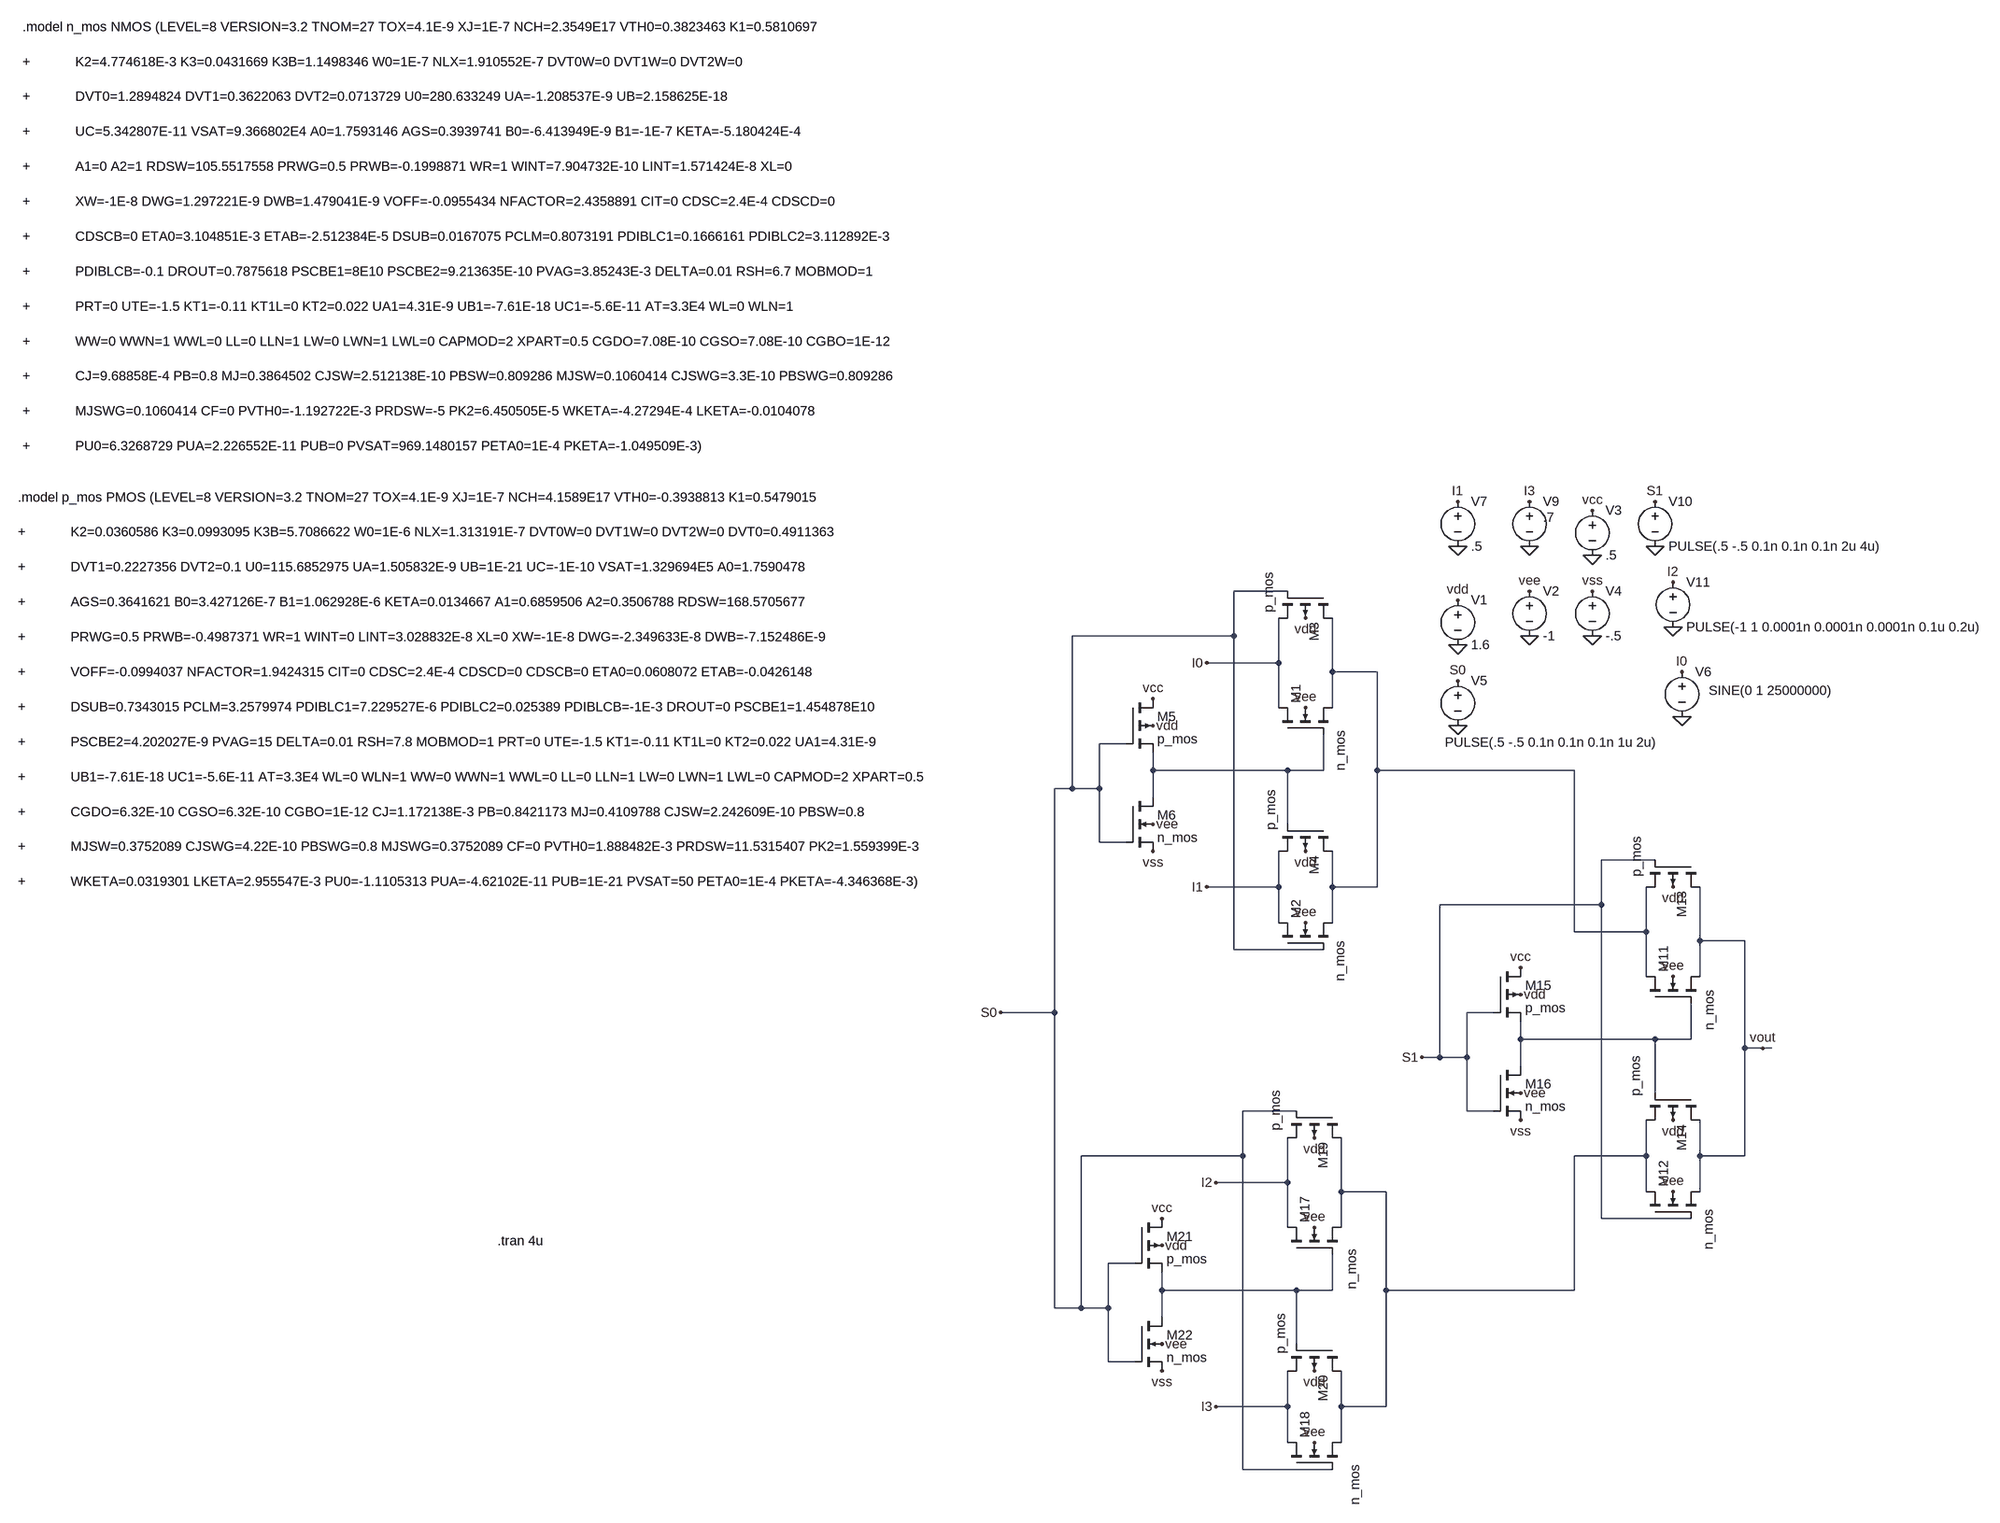
[diagram p0: schematic Data Acquisition System.asc]
Data Acquisition System.asc, the LTspice schematic file:
Version 4
SHEET 1 3424 1956
WIRE 1104 320 1008 320
WIRE 1008 400 1008 320
WIRE 1008 400 720 400
WIRE 1088 448 1088 368
WIRE 1088 448 960 448
WIRE 1184 464 1184 368
WIRE 1264 464 1184 464
WIRE 1088 528 1088 448
WIRE 1184 528 1184 464
WIRE 816 592 768 592
WIRE 864 640 864 608
WIRE 1104 640 864 640
WIRE 1168 640 1168 576
WIRE 1168 640 1104 640
WIRE 1264 640 1264 464
WIRE 1616 640 1264 640
WIRE 720 672 720 400
WIRE 720 672 688 672
WIRE 768 672 768 592
WIRE 768 672 720 672
WIRE 864 688 864 640
WIRE 1104 736 1104 640
WIRE 768 768 768 672
WIRE 816 768 768 768
WIRE 1760 800 1664 800
WIRE 1088 848 1088 784
WIRE 1088 848 960 848
WIRE 1184 848 1184 784
WIRE 1264 848 1264 640
WIRE 1264 848 1184 848
WIRE 1664 880 1664 800
WIRE 1664 880 1376 880
WIRE 1088 912 1088 848
WIRE 1184 912 1184 848
WIRE 1616 928 1616 640
WIRE 1744 928 1744 848
WIRE 1744 928 1616 928
WIRE 1840 944 1840 848
WIRE 1920 944 1840 944
WIRE 1008 960 1008 400
WIRE 1168 960 1008 960
WIRE 1744 1008 1744 928
WIRE 1840 1008 1840 944
WIRE 688 1072 688 672
WIRE 688 1072 592 1072
WIRE 1472 1072 1424 1072
WIRE 1520 1120 1520 1088
WIRE 1760 1120 1520 1120
WIRE 1824 1120 1824 1056
WIRE 1824 1120 1760 1120
WIRE 1920 1136 1920 944
WIRE 1952 1136 1920 1136
WIRE 1968 1136 1952 1136
WIRE 1376 1152 1376 880
WIRE 1376 1152 1344 1152
WIRE 1424 1152 1424 1072
WIRE 1424 1152 1376 1152
WIRE 1520 1168 1520 1120
WIRE 1760 1216 1760 1120
WIRE 1120 1248 1024 1248
WIRE 1424 1248 1424 1152
WIRE 1472 1248 1424 1248
WIRE 1024 1328 1024 1248
WIRE 1024 1328 736 1328
WIRE 1744 1328 1744 1264
WIRE 1744 1328 1616 1328
WIRE 1840 1328 1840 1264
WIRE 1920 1328 1920 1136
WIRE 1920 1328 1840 1328
WIRE 1104 1376 1104 1296
WIRE 1104 1376 976 1376
WIRE 1200 1392 1200 1296
WIRE 1280 1392 1200 1392
WIRE 1744 1392 1744 1328
WIRE 1840 1392 1840 1328
WIRE 1664 1440 1664 880
WIRE 1824 1440 1664 1440
WIRE 1104 1456 1104 1376
WIRE 1200 1456 1200 1392
WIRE 832 1520 784 1520
WIRE 880 1568 880 1536
WIRE 1120 1568 880 1568
WIRE 1184 1568 1184 1504
WIRE 1184 1568 1120 1568
WIRE 1280 1568 1280 1392
WIRE 1616 1568 1616 1328
WIRE 1616 1568 1280 1568
WIRE 688 1600 688 1072
WIRE 736 1600 736 1328
WIRE 736 1600 688 1600
WIRE 784 1600 784 1520
WIRE 784 1600 736 1600
WIRE 880 1616 880 1568
WIRE 1120 1664 1120 1568
WIRE 784 1696 784 1600
WIRE 832 1696 784 1696
WIRE 1104 1776 1104 1712
WIRE 1104 1776 976 1776
WIRE 1200 1776 1200 1712
WIRE 1280 1776 1280 1568
WIRE 1280 1776 1200 1776
WIRE 1104 1840 1104 1776
WIRE 1200 1840 1200 1776
WIRE 1024 1888 1024 1328
WIRE 1184 1888 1024 1888
FLAG 1408 416 0
FLAG 1536 400 0
FLAG 1648 256 0
FLAG 1648 400 0
FLAG 1408 560 0
FLAG 1808 544 0
FLAG 1408 336 vdd
FLAG 1136 368 vdd
FLAG 1136 784 vdd
FLAG 1536 320 vee
FLAG 1136 528 vee
FLAG 1136 912 vee
FLAG 1648 176 vcc
FLAG 864 512 vcc
FLAG 1648 320 vss
FLAG 864 784 vss
FLAG 960 448 I0
FLAG 1808 464 I0
FLAG 960 848 I1
FLAG 1408 160 I1
FLAG 1408 240 0
FLAG 864 560 vdd
FLAG 864 736 vee
FLAG 1792 848 vdd
FLAG 1792 1264 vdd
FLAG 1792 1008 vee
FLAG 1792 1392 vee
FLAG 1520 992 vcc
FLAG 1520 1264 vss
FLAG 1520 1040 vdd
FLAG 1520 1216 vee
FLAG 1152 1296 vdd
FLAG 1152 1712 vdd
FLAG 1152 1456 vee
FLAG 1152 1840 vee
FLAG 880 1440 vcc
FLAG 880 1712 vss
FLAG 880 1488 vdd
FLAG 880 1664 vee
FLAG 592 1072 S0
FLAG 1408 480 S0
FLAG 1536 240 0
FLAG 976 1376 I2
FLAG 976 1776 I3
FLAG 1536 160 I3
FLAG 1760 240 0
FLAG 1344 1152 S1
FLAG 1760 160 S1
FLAG 1792 384 0
FLAG 1792 304 I2
FLAG 1952 1136 vout
SYMBOL nmos4 1088 576 R270
WINDOW 3 -65 111 Left 2
SYMATTR Value n_mos
SYMATTR InstName M1
SYMATTR Value2 l=0.18u w=0.36u
SYMBOL nmos4 1088 960 R270
WINDOW 3 -57 110 Left 2
SYMATTR Value n_mos
SYMATTR InstName M2
SYMATTR Value2 l=0.18u w=0.36u
SYMBOL pmos4 1184 320 R90
WINDOW 3 -34 113 Left 2
SYMATTR Value p_mos
SYMATTR InstName M3
SYMATTR Value2 l=0.18u w=0.9u
SYMBOL pmos4 1184 736 R90
WINDOW 3 -62 109 Left 2
SYMATTR Value p_mos
SYMATTR InstName M4
SYMATTR Value2 l=0.18u w=0.9u
SYMBOL pmos4 816 512 R0
SYMATTR InstName M5
SYMATTR Value p_mos
SYMATTR Value2 l=0.18u w=0.9u
SYMBOL nmos4 816 688 R0
SYMATTR InstName M6
SYMATTR Value n_mos
SYMATTR Value2 l=0.18u w=0.36u
SYMBOL voltage 1408 320 R0
WINDOW 123 0 0 Left 0
WINDOW 39 0 0 Left 0
SYMATTR InstName V1
SYMATTR Value 1.6
SYMBOL voltage 1536 304 R0
WINDOW 123 0 0 Left 0
WINDOW 39 0 0 Left 0
SYMATTR InstName V2
SYMATTR Value -1
SYMBOL voltage 1648 160 R0
WINDOW 123 0 0 Left 0
WINDOW 39 0 0 Left 0
SYMATTR InstName V3
SYMATTR Value .5
SYMBOL voltage 1648 304 R0
WINDOW 123 0 0 Left 0
WINDOW 39 0 0 Left 0
SYMATTR InstName V4
SYMATTR Value -.5
SYMBOL voltage 1408 464 R0
WINDOW 3 -23 126 Left 2
WINDOW 123 0 0 Left 0
WINDOW 39 0 0 Left 0
SYMATTR Value PULSE(.5 -.5 0.1n 0.1n 0.1n 1u 2u)
SYMATTR InstName V5
SYMBOL voltage 1808 448 R0
WINDOW 3 48 49 Left 2
WINDOW 123 0 0 Left 0
WINDOW 39 0 0 Left 0
SYMATTR Value SINE(0 1 25000000)
SYMATTR InstName V6
SYMBOL voltage 1408 144 R0
WINDOW 123 0 0 Left 0
WINDOW 39 0 0 Left 0
SYMATTR InstName V7
SYMATTR Value .5
SYMBOL nmos4 1744 1056 R270
WINDOW 3 -48 113 Left 2
SYMATTR Value n_mos
SYMATTR InstName M11
SYMATTR Value2 l=0.18u w=0.36u
SYMBOL nmos4 1744 1440 R270
WINDOW 3 -56 112 Left 2
SYMATTR Value n_mos
SYMATTR InstName M12
SYMATTR Value2 l=0.18u w=0.36u
SYMBOL pmos4 1840 800 R90
WINDOW 3 -43 113 Left 2
SYMATTR Value p_mos
SYMATTR InstName M13
SYMATTR Value2 l=0.18u w=0.9u
SYMBOL pmos4 1840 1216 R90
WINDOW 3 -67 114 Left 2
SYMATTR Value p_mos
SYMATTR InstName M14
SYMATTR Value2 l=0.18u w=0.9u
SYMBOL pmos4 1472 992 R0
SYMATTR InstName M15
SYMATTR Value p_mos
SYMATTR Value2 l=0.18u w=0.9u
SYMBOL nmos4 1472 1168 R0
SYMATTR InstName M16
SYMATTR Value n_mos
SYMATTR Value2 l=0.18u w=0.36u
SYMBOL nmos4 1104 1504 R270
WINDOW 3 -63 115 Left 2
SYMATTR Value n_mos
SYMATTR InstName M17
SYMATTR Value2 l=0.18u w=0.36u
SYMBOL nmos4 1104 1888 R270
WINDOW 3 -64 121 Left 2
SYMATTR Value n_mos
SYMATTR InstName M18
SYMATTR Value2 l=0.18u w=0.36u
SYMBOL pmos4 1200 1248 R90
WINDOW 3 -37 117 Left 2
SYMATTR Value p_mos
SYMATTR InstName M19
SYMATTR Value2 l=0.18u w=0.9u
SYMBOL pmos4 1200 1664 R90
WINDOW 3 -55 108 Left 2
SYMATTR Value p_mos
SYMATTR InstName M20
SYMATTR Value2 l=0.18u w=0.9u
SYMBOL pmos4 832 1440 R0
SYMATTR InstName M21
SYMATTR Value p_mos
SYMATTR Value2 l=0.18u w=0.9u
SYMBOL nmos4 832 1616 R0
SYMATTR InstName M22
SYMATTR Value n_mos
SYMATTR Value2 l=0.18u w=0.36u
SYMBOL voltage 1536 144 R0
WINDOW 3 24 44 Left 2
WINDOW 123 0 0 Left 0
WINDOW 39 0 0 Left 0
SYMATTR Value .7
SYMATTR InstName V9
SYMBOL voltage 1760 144 R0
WINDOW 123 0 0 Left 0
WINDOW 39 0 0 Left 0
SYMATTR InstName V10
SYMATTR Value PULSE(.5 -.5 0.1n 0.1n 0.1n 2u 4u)
SYMBOL voltage 1792 288 R0
WINDOW 123 0 0 Left 0
WINDOW 39 0 0 Left 0
SYMATTR InstName V11
SYMATTR Value PULSE(-1 1 0.0001n 0.0001n 0.0001n 0.1u 0.2u)
TEXT -1184 1480 Left 2 !.tran 4u
TEXT -2032 -688 Left 2 !.model n_mos NMOS (LEVEL=8 VERSION=3.2 TNOM=27 TOX=4.1E-9 XJ=1E-7 NCH=2.3549E17 VTH0=0.3823463 K1=0.5810697 \n \n+            K2=4.774618E-3 K3=0.0431669 K3B=1.1498346 W0=1E-7 NLX=1.910552E-7 DVT0W=0 DVT1W=0 DVT2W=0 \n \n+            DVT0=1.2894824 DVT1=0.3622063 DVT2=0.0713729 U0=280.633249 UA=-1.208537E-9 UB=2.158625E-18\n \n+            UC=5.342807E-11 VSAT=9.366802E4 A0=1.7593146 AGS=0.3939741 B0=-6.413949E-9 B1=-1E-7 KETA=-5.180424E-4\n \n+            A1=0 A2=1 RDSW=105.5517558 PRWG=0.5 PRWB=-0.1998871 WR=1 WINT=7.904732E-10 LINT=1.571424E-8 XL=0\n \n+            XW=-1E-8 DWG=1.297221E-9 DWB=1.479041E-9 VOFF=-0.0955434 NFACTOR=2.4358891 CIT=0 CDSC=2.4E-4 CDSCD=0\n \n+            CDSCB=0 ETA0=3.104851E-3 ETAB=-2.512384E-5 DSUB=0.0167075 PCLM=0.8073191 PDIBLC1=0.1666161 PDIBLC2=3.112892E-3    \n \n+            PDIBLCB=-0.1 DROUT=0.7875618 PSCBE1=8E10 PSCBE2=9.213635E-10 PVAG=3.85243E-3 DELTA=0.01 RSH=6.7 MOBMOD=1\n \n+            PRT=0 UTE=-1.5 KT1=-0.11 KT1L=0 KT2=0.022 UA1=4.31E-9 UB1=-7.61E-18 UC1=-5.6E-11 AT=3.3E4 WL=0 WLN=1\n \n+            WW=0 WWN=1 WWL=0 LL=0 LLN=1 LW=0 LWN=1 LWL=0 CAPMOD=2 XPART=0.5 CGDO=7.08E-10 CGSO=7.08E-10 CGBO=1E-12\n \n+            CJ=9.68858E-4 PB=0.8 MJ=0.3864502 CJSW=2.512138E-10 PBSW=0.809286 MJSW=0.1060414 CJSWG=3.3E-10 PBSWG=0.809286 \n \n+            MJSWG=0.1060414 CF=0 PVTH0=-1.192722E-3 PRDSW=-5 PK2=6.450505E-5 WKETA=-4.27294E-4 LKETA=-0.0104078 \n \n+            PU0=6.3268729 PUA=2.226552E-11 PUB=0 PVSAT=969.1480157 PETA0=1E-4 PKETA=-1.049509E-3)
TEXT -2040 152 Left 2 !.model p_mos PMOS (LEVEL=8 VERSION=3.2 TNOM=27 TOX=4.1E-9 XJ=1E-7 NCH=4.1589E17 VTH0=-0.3938813 K1=0.5479015\n \n+            K2=0.0360586 K3=0.0993095 K3B=5.7086622 W0=1E-6 NLX=1.313191E-7 DVT0W=0 DVT1W=0 DVT2W=0 DVT0=0.4911363\n \n+            DVT1=0.2227356 DVT2=0.1 U0=115.6852975 UA=1.505832E-9 UB=1E-21 UC=-1E-10 VSAT=1.329694E5 A0=1.7590478\n \n+            AGS=0.3641621 B0=3.427126E-7 B1=1.062928E-6 KETA=0.0134667 A1=0.6859506 A2=0.3506788 RDSW=168.5705677\n \n+            PRWG=0.5 PRWB=-0.4987371 WR=1 WINT=0 LINT=3.028832E-8 XL=0 XW=-1E-8 DWG=-2.349633E-8 DWB=-7.152486E-9 \n \n+            VOFF=-0.0994037 NFACTOR=1.9424315 CIT=0 CDSC=2.4E-4 CDSCD=0 CDSCB=0 ETA0=0.0608072 ETAB=-0.0426148\n \n+            DSUB=0.7343015 PCLM=3.2579974 PDIBLC1=7.229527E-6 PDIBLC2=0.025389 PDIBLCB=-1E-3 DROUT=0 PSCBE1=1.454878E10\n \n+            PSCBE2=4.202027E-9 PVAG=15 DELTA=0.01 RSH=7.8 MOBMOD=1 PRT=0 UTE=-1.5 KT1=-0.11 KT1L=0 KT2=0.022 UA1=4.31E-9\n \n+            UB1=-7.61E-18 UC1=-5.6E-11 AT=3.3E4 WL=0 WLN=1 WW=0 WWN=1 WWL=0 LL=0 LLN=1 LW=0 LWN=1 LWL=0 CAPMOD=2 XPART=0.5\n \n+            CGDO=6.32E-10 CGSO=6.32E-10 CGBO=1E-12 CJ=1.172138E-3 PB=0.8421173 MJ=0.4109788 CJSW=2.242609E-10 PBSW=0.8            \n \n+            MJSW=0.3752089 CJSWG=4.22E-10 PBSWG=0.8 MJSWG=0.3752089 CF=0 PVTH0=1.888482E-3 PRDSW=11.5315407 PK2=1.559399E-3    \n \n+            WKETA=0.0319301 LKETA=2.955547E-3 PU0=-1.1105313 PUA=-4.62102E-11 PUB=1E-21 PVSAT=50 PETA0=1E-4 PKETA=-4.346368E-3)

The netlist it stands for:
* Data Acquisition System.asc
M1 I0 N002 N001 vee n_mos l=0.18u w=0.36u
M2 I1 S0 N001 vee n_mos l=0.18u w=0.36u
M3 N001 S0 I0 vdd p_mos l=0.18u w=0.9u
M4 N001 N002 I1 vdd p_mos l=0.18u w=0.9u
M5 vcc S0 N002 vdd p_mos l=0.18u w=0.9u
M6 N002 S0 vss vee n_mos l=0.18u w=0.36u
V1 vdd 0 1.6
V2 vee 0 -1
V3 vcc 0 .5
V4 vss 0 -.5
V5 S0 0 PULSE(.5 -.5 0.1n 0.1n 0.1n 1u 2u)
V6 I0 0 SINE(0 1 25000000)
V7 I1 0 .5
M11 N001 N003 vout vee n_mos l=0.18u w=0.36u
M12 N004 S1 vout vee n_mos l=0.18u w=0.36u
M13 vout S1 N001 vdd p_mos l=0.18u w=0.9u
M14 vout N003 N004 vdd p_mos l=0.18u w=0.9u
M15 vcc S1 N003 vdd p_mos l=0.18u w=0.9u
M16 N003 S1 vss vee n_mos l=0.18u w=0.36u
M17 I2 N005 N004 vee n_mos l=0.18u w=0.36u
M18 I3 S0 N004 vee n_mos l=0.18u w=0.36u
M19 N004 S0 I2 vdd p_mos l=0.18u w=0.9u
M20 N004 N005 I3 vdd p_mos l=0.18u w=0.9u
M21 vcc S0 N005 vdd p_mos l=0.18u w=0.9u
M22 N005 S0 vss vee n_mos l=0.18u w=0.36u
V9 I3 0 .7
V10 S1 0 PULSE(.5 -.5 0.1n 0.1n 0.1n 2u 4u)
V11 I2 0 PULSE(-1 1 0.0001n 0.0001n 0.0001n 0.1u 0.2u)
.model NMOS NMOS
.model PMOS PMOS
.lib standard.mos
.tran 4u
.model n_mos NMOS (LEVEL=8 VERSION=3.2 TNOM=27 TOX=4.1E-9 XJ=1E-7 NCH=2.3549E17 VTH0=0.3823463 K1=0.5810697
+            K2=4.774618E-3 K3=0.0431669 K3B=1.1498346 W0=1E-7 NLX=1.910552E-7 DVT0W=0 DVT1W=0 DVT2W=0
+            DVT0=1.2894824 DVT1=0.3622063 DVT2=0.0713729 U0=280.633249 UA=-1.208537E-9 UB=2.158625E-18
+            UC=5.342807E-11 VSAT=9.366802E4 A0=1.7593146 AGS=0.3939741 B0=-6.413949E-9 B1=-1E-7 KETA=-5.180424E-4
+            A1=0 A2=1 RDSW=105.5517558 PRWG=0.5 PRWB=-0.1998871 WR=1 WINT=7.904732E-10 LINT=1.571424E-8 XL=0
+            XW=-1E-8 DWG=1.297221E-9 DWB=1.479041E-9 VOFF=-0.0955434 NFACTOR=2.4358891 CIT=0 CDSC=2.4E-4 CDSCD=0
+            CDSCB=0 ETA0=3.104851E-3 ETAB=-2.512384E-5 DSUB=0.0167075 PCLM=0.8073191 PDIBLC1=0.1666161 PDIBLC2=3.112892E-3
+            PDIBLCB=-0.1 DROUT=0.7875618 PSCBE1=8E10 PSCBE2=9.213635E-10 PVAG=3.85243E-3 DELTA=0.01 RSH=6.7 MOBMOD=1
+            PRT=0 UTE=-1.5 KT1=-0.11 KT1L=0 KT2=0.022 UA1=4.31E-9 UB1=-7.61E-18 UC1=-5.6E-11 AT=3.3E4 WL=0 WLN=1
+            WW=0 WWN=1 WWL=0 LL=0 LLN=1 LW=0 LWN=1 LWL=0 CAPMOD=2 XPART=0.5 CGDO=7.08E-10 CGSO=7.08E-10 CGBO=1E-12
+            CJ=9.68858E-4 PB=0.8 MJ=0.3864502 CJSW=2.512138E-10 PBSW=0.809286 MJSW=0.1060414 CJSWG=3.3E-10 PBSWG=0.809286
+            MJSWG=0.1060414 CF=0 PVTH0=-1.192722E-3 PRDSW=-5 PK2=6.450505E-5 WKETA=-4.27294E-4 LKETA=-0.0104078
+            PU0=6.3268729 PUA=2.226552E-11 PUB=0 PVSAT=969.1480157 PETA0=1E-4 PKETA=-1.049509E-3)
.model p_mos PMOS (LEVEL=8 VERSION=3.2 TNOM=27 TOX=4.1E-9 XJ=1E-7 NCH=4.1589E17 VTH0=-0.3938813 K1=0.5479015
+            K2=0.0360586 K3=0.0993095 K3B=5.7086622 W0=1E-6 NLX=1.313191E-7 DVT0W=0 DVT1W=0 DVT2W=0 DVT0=0.4911363
+            DVT1=0.2227356 DVT2=0.1 U0=115.6852975 UA=1.505832E-9 UB=1E-21 UC=-1E-10 VSAT=1.329694E5 A0=1.7590478
+            AGS=0.3641621 B0=3.427126E-7 B1=1.062928E-6 KETA=0.0134667 A1=0.6859506 A2=0.3506788 RDSW=168.5705677
+            PRWG=0.5 PRWB=-0.4987371 WR=1 WINT=0 LINT=3.028832E-8 XL=0 XW=-1E-8 DWG=-2.349633E-8 DWB=-7.152486E-9
+            VOFF=-0.0994037 NFACTOR=1.9424315 CIT=0 CDSC=2.4E-4 CDSCD=0 CDSCB=0 ETA0=0.0608072 ETAB=-0.0426148
+            DSUB=0.7343015 PCLM=3.2579974 PDIBLC1=7.229527E-6 PDIBLC2=0.025389 PDIBLCB=-1E-3 DROUT=0 PSCBE1=1.454878E10
+            PSCBE2=4.202027E-9 PVAG=15 DELTA=0.01 RSH=7.8 MOBMOD=1 PRT=0 UTE=-1.5 KT1=-0.11 KT1L=0 KT2=0.022 UA1=4.31E-9
+            UB1=-7.61E-18 UC1=-5.6E-11 AT=3.3E4 WL=0 WLN=1 WW=0 WWN=1 WWL=0 LL=0 LLN=1 LW=0 LWN=1 LWL=0 CAPMOD=2 XPART=0.5
+            CGDO=6.32E-10 CGSO=6.32E-10 CGBO=1E-12 CJ=1.172138E-3 PB=0.8421173 MJ=0.4109788 CJSW=2.242609E-10 PBSW=0.8
+            MJSW=0.3752089 CJSWG=4.22E-10 PBSWG=0.8 MJSWG=0.3752089 CF=0 PVTH0=1.888482E-3 PRDSW=11.5315407 PK2=1.559399E-3
+            WKETA=0.0319301 LKETA=2.955547E-3 PU0=-1.1105313 PUA=-4.62102E-11 PUB=1E-21 PVSAT=50 PETA0=1E-4 PKETA=-4.346368E-3)
.backanno
.end